# EAGLE schematic msx_rc2014_adapter (EAGLE 7.6.0)
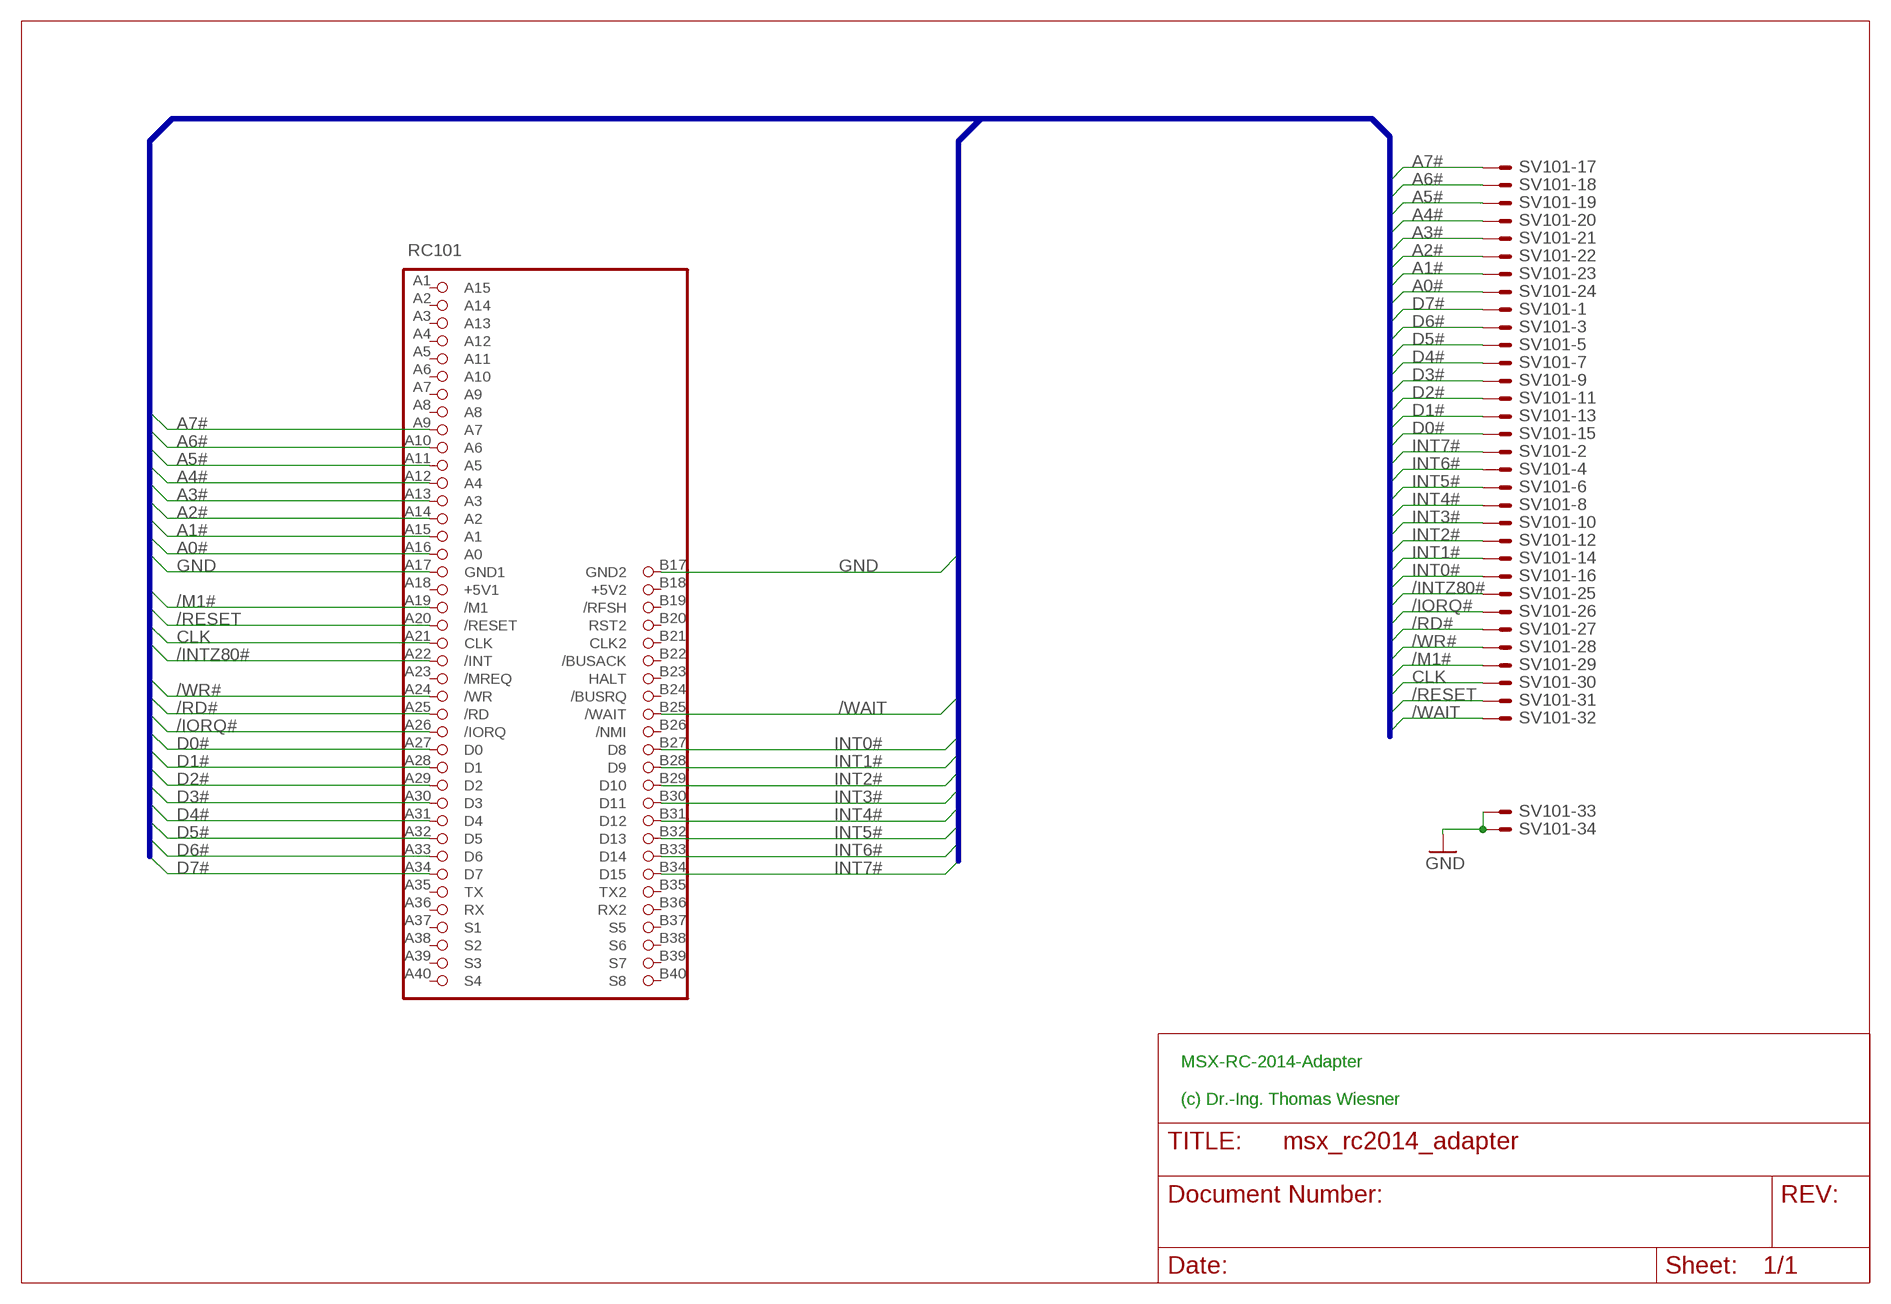
[diagram p0: schematic, sheet 1]

## Parts
RC101  RC2014STECKER  [RC2014-STECKER]
SV101  ML343MLE  [3M_34L]

## Nets
/INTZ80#: RC101.A22(/INT) SV101.25
/IORQ#: RC101.A26(/IORQ) SV101.26
/M1#: RC101.A19(/M1) SV101.29
/RD#: RC101.A25(/RD) SV101.27
/RESET: RC101.A20(/RESET) SV101.31
/WAIT: RC101.B25(/WAIT) SV101.32
/WR#: RC101.A24(/WR) SV101.28
A0#: RC101.A16(A0) SV101.24
A1#: RC101.A15(A1) SV101.23
A2#: RC101.A14(A2) SV101.22
A3#: RC101.A13(A3) SV101.21
A4#: RC101.A12(A4) SV101.20
A5#: RC101.A11(A5) SV101.19
A6#: RC101.A10(A6) SV101.18
A7#: RC101.A9(A7) SV101.17
CLK: RC101.A21(CLK) SV101.30
D0#: RC101.A27(D0) SV101.15
D1#: RC101.A28(D1) SV101.13
D2#: RC101.A29(D2) SV101.11
D3#: RC101.A30(D3) SV101.9
D4#: RC101.A31(D4) SV101.7
D5#: RC101.A32(D5) SV101.5
D6#: RC101.A33(D6) SV101.3
D7#: RC101.A34(D7) SV101.1
GND: RC101.A17(GND1) RC101.B17(GND2) SV101.33 SV101.34
INT0#: RC101.B27(D8) SV101.16
INT1#: RC101.B28(D9) SV101.14
INT2#: RC101.B29(D10) SV101.12
INT3#: RC101.B30(D11) SV101.10
INT4#: RC101.B31(D12) SV101.8
INT5#: RC101.B32(D13) SV101.6
INT6#: RC101.B33(D14) SV101.4
INT7#: RC101.B34(D15) SV101.2
Unconnected: RC101.A1(A15) RC101.A2(A14) RC101.A3(A13) RC101.A4(A12) RC101.A5(A11) RC101.A6(A10) RC101.A7(A9) RC101.A8 RC101.A18(+5V1) RC101.A23(/MREQ) RC101.A35(TX) RC101.A36(RX) RC101.A37(S1) RC101.A38(S2) RC101.A39(S3) RC101.A40(S4) RC101.B18(+5V2) RC101.B19(/RFSH) RC101.B20(RST2) RC101.B21(CLK2) RC101.B22(/BUSACK) RC101.B23(HALT) RC101.B24(/BUSRQ) RC101.B26(/NMI) RC101.B35(TX2) RC101.B36(RX2) RC101.B37(S5) RC101.B38(S6) RC101.B39(S7) RC101.B40(S8)

## Buses
IO_BUS

## Notes on the sheet
- MSX-RC-2014-Adapter
  
  (c) Dr.-Ing. Thomas Wiesner

## Library data of the parts
RC101 = mbc:RC2014: RC-2014-Steckverbinder Modul
SV101 = con-harting-ml:ML34?E: HARTING; OC_FARNELL: unknown; OC_NEWARK: unknown